# EAGLE design ESP_rgb_led_server_revA (EAGLE 7.3.0)
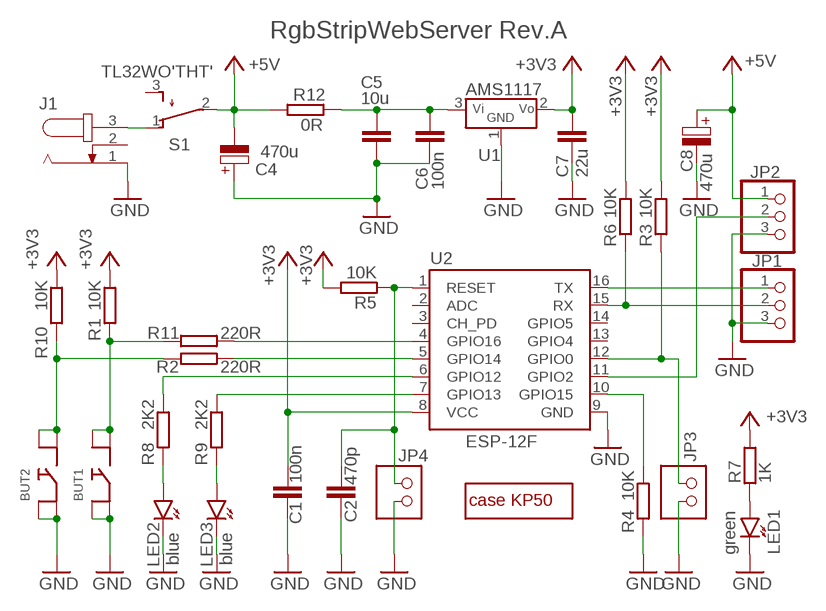
[diagram p0: schematic, sheet 1]

## Parts
BUT1  BUTTON'SMD'  [BUTTON_SMD]
BUT2  BUTTON'SMD'  [BUTTON_SMD]
C1  100n  C-CERAMIC'SMD'  [C0805]
C2  470p  C-CERAMIC'SMD'  [C0805]
C4  470u  C-POLY'10MM/90'  [ELYT-10MM/90]
C5  10u  C-CERAMIC'SMD'  [C0805]
C6  100n  C-CERAMIC'SMD'  [C0805]
C7  22u  C-CERAMIC'SMD'  [C0805]
C8  470u  C-POLY'10MM/90'  [ELYT-10MM/90]
J1  JACK-PLUG1  [SPC4078]
JP1  PINHD-3X1  [PINHD-3X1]
JP2  PINHD-3X1  [PINHD-3X1]
JP3  PINHD-2X1  [PINHD-2X1]
JP4  PINHD-2X1  [PINHD-2X1]
LED1  green  LED'3MM'  [LED3MM]
LED2  blue  LED'3MM'  [LED3MM]
LED3  blue  LED'3MM'  [LED3MM]
R1  10K  R'2'  [R0805]
R2  220R  R'2'  [R0805]
R3  10K  R'2'  [R0805]
R4  10K  R'2'  [R0805]
R5  10K  R'2'  [R0805]
R6  10K  R'2'  [R0805]
R7  1K  R'2'  [R0805]
R8  2K2  R'2'  [R0805]
R9  2K2  R'2'  [R0805]
R10  10K  R'2'  [R0805]
R11  220R  R'2'  [R0805]
R12  0R  R'2'  [R0805]
S1  TL32WO'THT'  [TL3XWO]
U1  AMS1117  V_STAB'TS1117'  [SOT223]
U2  ESP-12F  [ESP-12F-ADAPTER]
U$1  CASE-KP50  [KP50-CASE]

## Nets
+3V3: C1.2 C7.2 R1.2 R3.2 R5.2 R6.2 R7.2 R10.2 U1.2(VOUT) U2.8(VCC)
+5V: C4.N(NEG) C8.P(POS) JP2.1 R12.2 S1.2(P)
GND: BUT1.1 BUT1.2 BUT2.1 BUT2.2 C1.1 C2.1 C4.P(POS) C5.1 C6.1 C7.1 C8.N(NEG) J1.1 JP1.3 JP2.3 JP3.2 JP4.2 LED1.K LED2.K LED3.K R4.1 U1.1(GND) U2.9(GND)
N$1: JP1.1 U2.16(TX)
N$2: JP3.1 R3.1 U2.12(GPIO0)
N$3: C2.2 JP4.1 R5.1 U2.1(RESET)
N$4: R4.2 U2.10(GPIO15)
N$5: JP1.2 R6.1 U2.15(RX)
N$6: JP2.2 U2.11(GPIO2)
N$7: J1.3 S1.1(O)
N$8: R11.2 U2.4(GPIO16)
N$9: LED1.A R7.1
N$10: R2.2 U2.5(GPIO14)
N$11: R8.2 U2.6(GPIO12)
N$12: LED2.A R8.1
N$13: R9.2 U2.7(GPIO13)
N$14: LED3.A R9.1
N$15: BUT2.3 BUT2.4 R2.1 R10.1
N$16: C5.2 C6.2 R12.1 U1.3(VIN)
N$17: BUT1.3 BUT1.4 R1.1 R11.1
Unconnected: J1.2 S1.3(S) U2.2(ADC) U2.3(CH_PD) U2.13(GPIO4) U2.14(GPIO5)

## Notes on the sheet
- RgbStripWebServer Rev.A

## Library data of the parts
BUT1 BUT2 = 1_domaci:BUTTON
C1 C2 C5-C7 = 1_domaci:C-CERAMIC
C4 C8 = 1_domaci:C-POLY
J1 = 1_domaci:JACK-PLUG: DC POWER JACK Power Jack, DC, Right Angle, Through Hole, Rated 5A at 16VDC, PC Terminals Distributor: Farnell (www.Farnell.de) Drawing: 84N1161.pdf / 84N1162.pdf Manufacturer: SPC Technology (www.spctechnology.com) Type: SPC4077 / SPC 4078; OC_FARNELL: unknown; OC_NEWARK: unknown
JP1 JP2 = 1_domaci:PINHD-3X1
JP3 JP4 = 1_domaci:PINHD-2X1
LED1-LED3 = 1_domaci:LED
R1-R12 = 1_domaci:R
S1 = 1_domaci:TL32WO: TINY SWITCH ON - MOM Source: http://www2.produktinfo.conrad.com/datenblaetter/700000-724999/705152-da-01-de-Subminiaturschalter_TL_36WO.pdf
U1 = 1_domaci:V_STAB
U2 = 1_domaci:ESP-12F
U$1 = 1_domaci:CASE-KP50

## Board
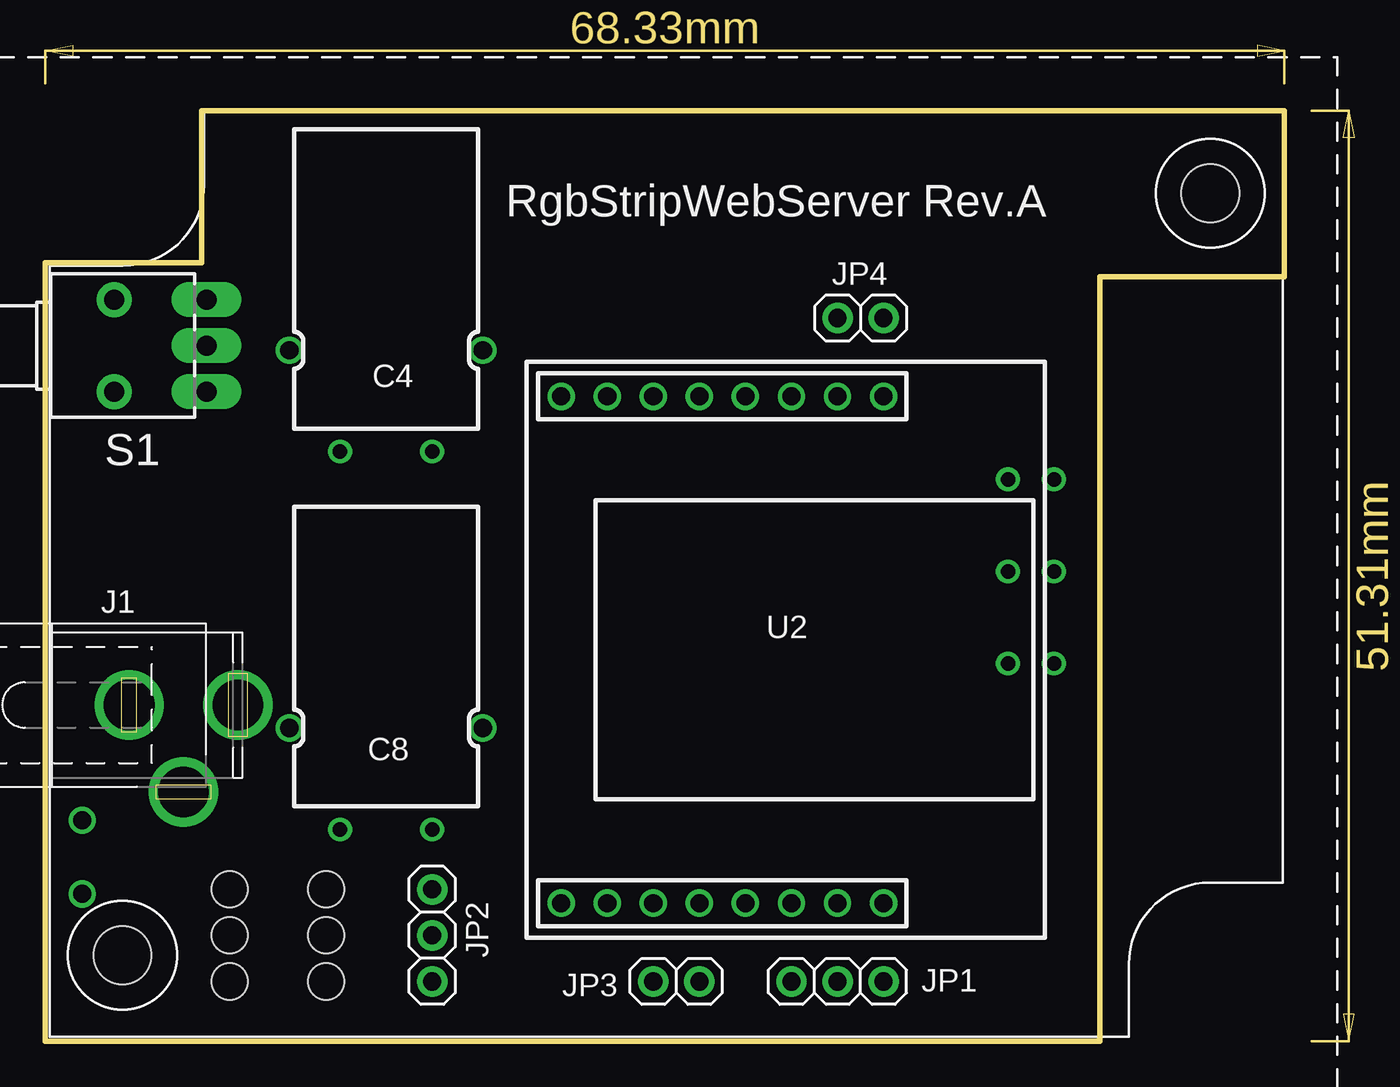
[diagram p1: board, top side]
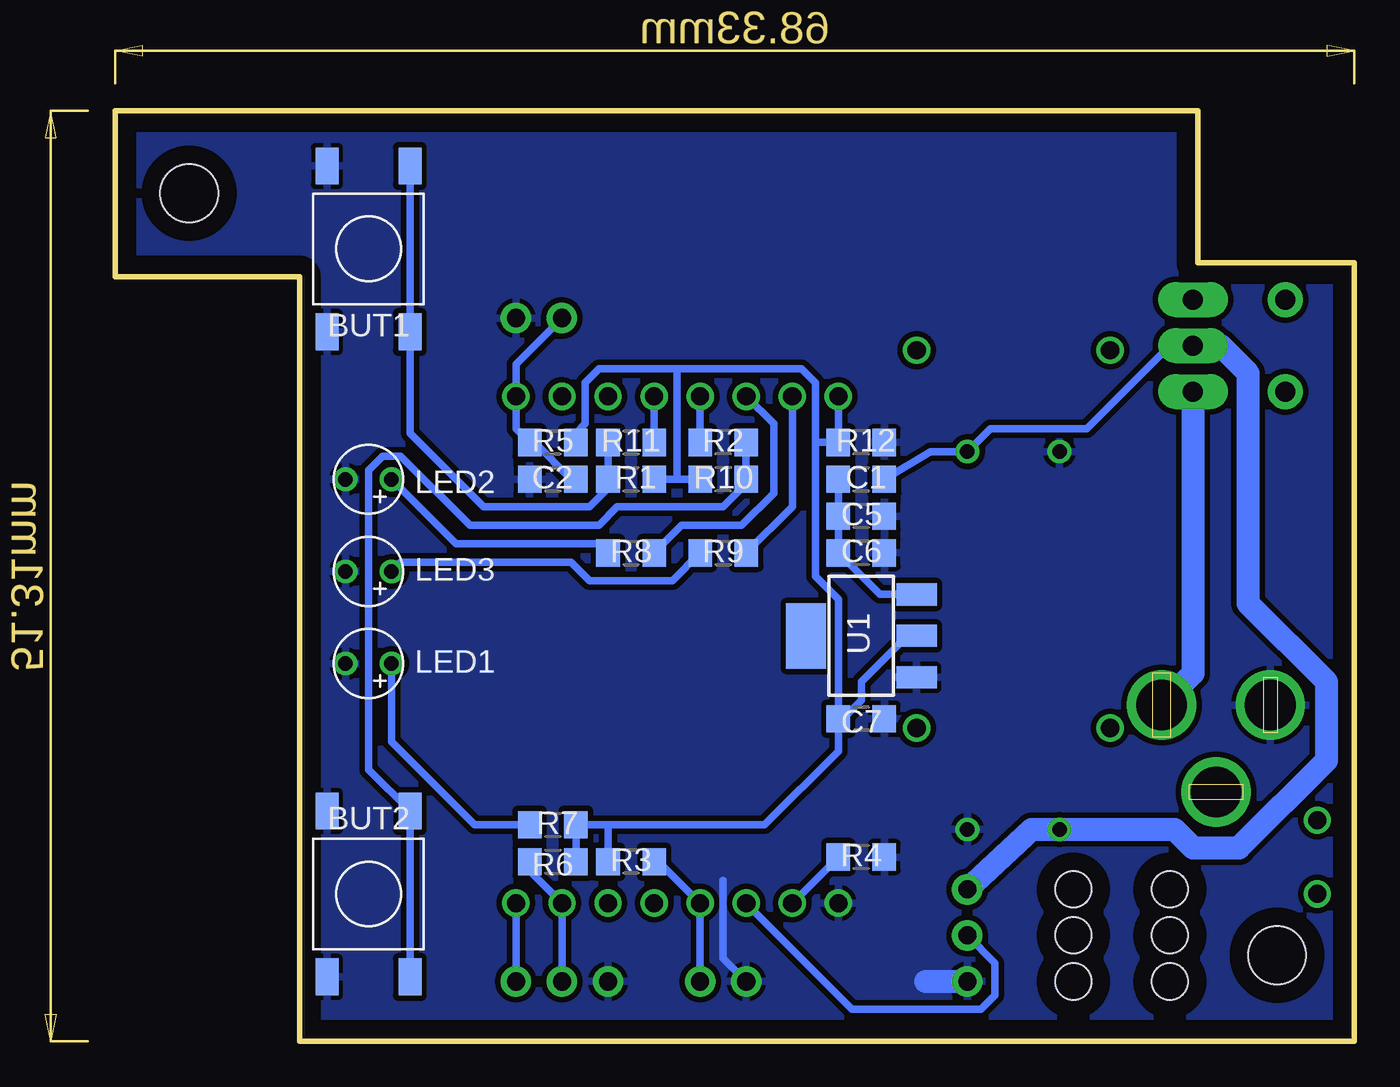
[diagram p2: board, bottom side, seen from below]

Size 68.33 x 51.31 mm. Coordinates in mm from the lower left corner, seen from the top.
Outline: 58.17,42.16 58.17,0 0,0 0,42.93 8.64,42.93 8.64,51.31 68.33,51.31 68.33,42.16 58.17,42.16
Copper layers (1*16): Top 0.035mm / dielectric 1.5mm / Bottom 0.035mm
Design rules "default *": minimum track width 10mil, minimum drill 24mil, track to track 12mil, track to pad 12mil, pad to pad 12mil, via to via 12mil, smd to smd 12mil, copper to edge 40mil, drill to drill 8mil, minimum pad ring 10mil, minimum via ring 8mil, stop-mask expansion 5mil, vias tented up to drill 0mil, thermal gap 10mil
Holes 2 mm at 15.49,8.38 15.49,5.84 15.49,3.3 10.16,8.38 10.16,5.84 10.16,3.3

### Footprints (pad centres in the part's own frame; a part is rotated, then mirrored left to right if it is on the bottom)
BUTTON_SMD = smd 2.032 x 1.27: 1 -4.572,-2.286; 2 4.572,-2.286; 3 4.572,2.286; 4 -4.572,2.286
C0805 = smd 1.3 x 1.5: 1 -1.27,0; 2 1.27,0
ELYT-10MM/90 = drill 0.8: N 2.54,0; P -2.54,0
SPC4078 = drill 2.8 pad 3.81: 1 -3,0; 2 0,-4.8; 3 3,0
PINHD-3X1 = drill 1 pad 1.676: 1 -2.54,0; 2 0,0; 3 2.54,0
PINHD-2X1 = drill 1 pad 1.676: 1 -1.27,0; 2 1.27,0
LED3MM = drill 0.8: A -1.27,0; K 1.27,0
R0805 = smd 1.3 x 1.5: 1 -1.27,0; 2 1.27,0
TL3XWO = drill 1.1 pad 1.93 long: 1 -2.54,-5.08; 2 0,-5.08; 3 2.54,-5.08 | drill 1.1 pad 1.93: M1 -2.54,0; M2 2.54,0
SOT223 = smd 1.219 x 2.235: 1 -2.286,-3.048; 2 0,-3.048; 3 2.286,-3.048 | smd 3.6 x 2.2: 4 0,3.048
ESP-12F-ADAPTER = drill 1: 1 -13.97,5.715; 2 -13.97,3.175; 3 -13.97,0.635; 4 -13.97,-1.905; 5 -13.97,-4.445; 6 -13.97,-6.985; 7 -13.97,-9.525; 8 -13.97,-12.065; 9 13.97,-12.065; 10 13.97,-9.525; 11 13.97,-6.985; 12 13.97,-4.445; 13 13.97,-1.905; 14 13.97,0.635; 15 13.97,3.175; 16 13.97,5.715
KP50-CASE = hole 3.2: 4,4.5; 64,46.5

### Placement (x,y rotation side)
BUT1  54.36,43.69 270 bottom
BUT2  54.36,8.13 270 bottom
C1  27.18,33.02 180 bottom
C2  44.2,30.99 0 bottom
C4  18.8,32.51 0 top
C5  27.18,28.96 180 bottom
C6  27.18,26.92 180 bottom
C7  27.18,17.78 180 bottom
C8  18.8,11.68 0 top
J1  7.62,18.54 0 top
JP1  43.69,3.3 180 top
JP2  21.34,5.84 270 top
JP3  34.8,3.3 180 top
JP4  44.96,39.88 0 top
LED1  54.36,20.83 180 bottom
LED2  54.36,30.99 180 bottom
LED3  54.36,25.91 180 bottom
R1  39.88,30.99 0 bottom
R2  34.8,33.02 180 bottom
R3  39.88,9.91 180 bottom
R4  27.18,10.16 180 bottom
R5  44.2,33.02 0 bottom
R6  44.2,9.91 0 bottom
R7  44.2,11.94 0 bottom
R8  39.88,26.92 0 bottom
R9  34.8,26.92 0 bottom
R10  34.8,30.99 180 bottom
R11  39.88,33.02 0 bottom
R12  27.18,30.99 0 bottom
S1  3.81,38.35 90 top
U1  27.18,22.35 90 bottom
U2  40.51,21.59 270 top
U$1  0.25,0.25 0 top

### Tracks (layer width: path | path; a pad name or v marks a point on that pad's centre or on a via)
+3V3
  Bottom 0.406: 29.72,33.02 29.72,25.65 28.45,24.38 C7.2 | U2.8 C1.2 29.72,33.02 | R1.2 37.34,30.99 | 37.34,30.99 R10.2 | U1.2 24.64,22.35 27.18,19.81 27.18,18.8 28.19,17.78 C7.2 | 29.72,33.02 29.72,36.32 30.48,37.08 37.34,37.08 | 37.34,37.08 41.66,37.08 42.42,36.32 42.42,34.04 42.93,33.53 R5.2 | 37.34,37.08 37.34,30.99 | C7.2 28.45,16 32.51,11.94 41.15,11.94 | 41.15,11.94 R7.2 R6.2 | R3.2 41.15,11.94
+5V
  Bottom 0.406: R12.2 23.37,32.51 C4.N 20.07,33.78 14.73,33.78 10.16,38.35 S1.2
  Bottom 1.27: JP2.1 17.78,11.68 C8.P 9.91,11.68 8.89,10.67 6.35,10.67 1.52,15.49 1.52,19.81 5.84,24.13 5.84,36.83 7.37,38.35 S1.2
GND
  Bottom 0.406: JP3.2 34.8,4.57 34.8,8.89
  Bottom 1.27: 23.62,3.3 JP2.3
  pour Bottom (rank 2): 0.51,42.42 0.51,0.51 57.66,0.51 57.66,42.67 67.82,42.67 67.82,50.8 9.14,50.8 9.14,42.42
N$1
  Bottom 0.406: JP1.1 U2.16
N$2
  Bottom 0.406: JP3.1 U2.12 38.35,9.91 R3.1
N$3
  Bottom 0.406: C2.2 43.18,30.99 45.21,33.02 R5.1 46.23,33.78 U2.1 46.23,37.34 JP4.1
N$4
  Bottom 0.406: U2.10 R4.2
N$5
  Bottom 0.406: JP1.2 U2.15 45.47,9.4 R6.1
N$6
  Bottom 0.406: U2.11 27.69,1.78 20.57,1.78 19.81,2.54 19.81,4.32 JP2.2
N$7
  Bottom 1.27: S1.1 8.89,20.27 J1.3
N$8
  Bottom 0.406: U2.4 R11.2
N$9
  Bottom 0.406: LED1.A 53.09,16.51 48.51,11.94 R7.1
N$10
  Bottom 0.406: U2.5 R2.2
N$11
  Bottom 0.406: U2.6 32,34.04 32,30.23 33.78,28.45 37.08,28.45 R8.2
N$12
  Bottom 0.406: R8.1 41.66,27.43 49.53,27.43 LED2.A
N$13
  Bottom 0.406: U2.7 30.99,29.46 R9.2
N$14
  Bottom 0.406: R9.1 37.59,25.4 42.16,25.4 43.18,26.42 52.58,26.42 LED3.A
N$15
  Bottom 0.406: R2.1 R10.1 33.53,30.73 34.8,29.46 40.64,29.46 41.66,28.45 48.77,28.45 52.58,32.26 53.59,32.26 54.36,31.5 54.36,14.99 BUT2.4 BUT2.3
N$16
  Bottom 0.406: R12.1 C5.2 C6.2 26.16,24.64 U1.3
N$17
  Bottom 0.406: R11.1 R1.1 41.15,30.48 42.16,29.46 48.01,29.46 52.07,33.53 BUT1.3 BUT1.4
N$18  (via drill 1)
  other vias: 24.13,38.1
N$19  (via drill 1)
  other vias: 13.46,38.1
N$20  (via drill 1)
  other vias: 24.13,17.27
N$21  (via drill 1)
  other vias: 13.46,17.27
N$22  (via drill 1)
  other vias: 2.03,8.13
N$23  (via drill 1)
  other vias: 2.03,12.19
N$24
  pour Bottom (rank 3, no thermals): 29.97,24.64 32,24.64 32,20.07 29.97,20.07

### Text on the board
tPlace: RgbStripWebServer Rev.A